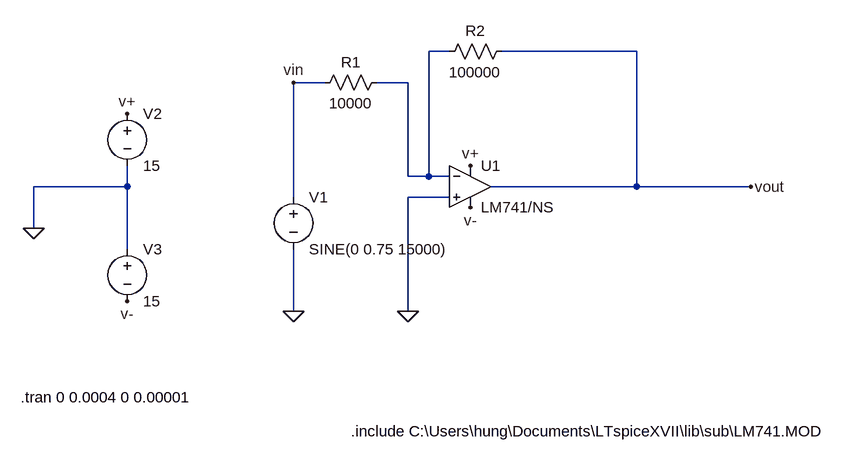
[diagram p0: schematic lab 7 part 3.asc]
lab 7 part 3.asc, the LTspice schematic file:
Version 4
SHEET 1 1252 680
WIRE 272 -112 240 -112
WIRE 560 -112 352 -112
WIRE 80 -64 32 -64
WIRE 208 -64 160 -64
WIRE 208 80 208 -64
WIRE 240 80 240 -112
WIRE 240 80 208 80
WIRE 272 80 240 80
WIRE -224 96 -224 64
WIRE -224 96 -368 96
WIRE 560 96 560 -112
WIRE 560 96 336 96
WIRE 736 96 560 96
WIRE 32 112 32 -64
WIRE 272 112 208 112
WIRE -368 160 -368 96
WIRE -224 192 -224 96
WIRE 32 288 32 192
WIRE 208 288 208 112
FLAG -368 160 0
FLAG 32 288 0
FLAG 208 288 0
FLAG -224 -16 v+
FLAG 304 64 v+
FLAG -224 272 v-
FLAG 304 128 v-
FLAG 32 -64 vin
FLAG 736 96 vout
SYMBOL voltage 32 96 R0
WINDOW 123 0 0 Left 0
WINDOW 39 0 0 Left 0
SYMATTR InstName V1
SYMATTR Value SINE(0 0.75 15000)
SYMBOL voltage -224 -32 R0
WINDOW 123 0 0 Left 0
WINDOW 39 0 0 Left 0
SYMATTR InstName V2
SYMATTR Value 15
SYMBOL voltage -224 176 R0
WINDOW 123 0 0 Left 0
WINDOW 39 0 0 Left 0
SYMATTR InstName V3
SYMATTR Value 15
SYMBOL res 176 -80 R90
WINDOW 0 0 56 VBottom 2
WINDOW 3 32 56 VTop 2
SYMATTR InstName R1
SYMATTR Value 10000
SYMBOL res 368 -128 R90
WINDOW 0 0 56 VBottom 2
WINDOW 3 32 56 VTop 2
SYMATTR InstName R2
SYMATTR Value 100000
SYMBOL Opamps\\opamp2 304 32 R0
SYMATTR InstName U1
SYMATTR Value LM741/NS
TEXT 120 472 Left 2 !.include C:\\Users\\hung\\Documents\\LTspiceXVII\\lib\\sub\\LM741.MOD
TEXT -388 420 Left 2 !.tran 0 0.0004 0 0.00001

The netlist it stands for:
* lab 7 part 3.asc
V1 vin 0 SINE(0 0.75 15000)
V2 v+ 0 15
V3 0 v- 15
R1 N001 vin 10000
R2 vout N001 100000
XU1 0 N001 v+ v- vout LM741/NS  ; pins In+ In- V+ V- OUT
.include C:\Users\hung\Documents\LTspiceXVII\lib\sub\LM741.MOD
.tran 0 0.0004 0 0.00001
.backanno
.end